# Altium project cyber60-mxhs.PrjPcb
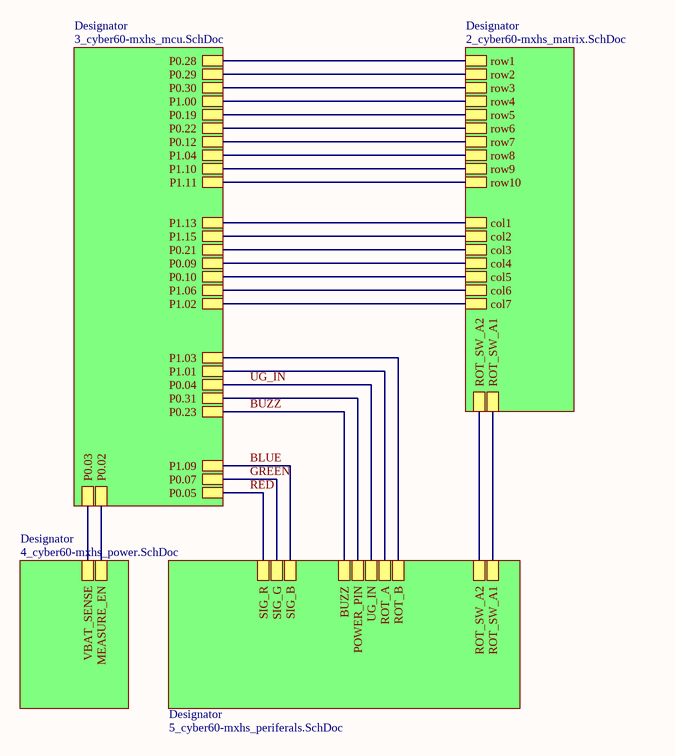
[diagram p0: 1_cyber60-mxhs_top.SchDoc]
ProjectTitle: cyber60 schematic; Revision: D2- MXHS
5 sheets, 227 parts. Net scope: hierarchical (ports join the sheet entries above them; power ports are global).
Board file: cyber60-mxhs.PcbDoc
Sheets:
  1_cyber60-mxhs_top.SchDoc
    Designator = 3_cyber60-mxhs_mcu.SchDoc
    Designator = 2_cyber60-mxhs_matrix.SchDoc
    Designator = 4_cyber60-mxhs_power.SchDoc
    Designator = 5_cyber60-mxhs_periferals.SchDoc

## Sheet 1_cyber60-mxhs_top.SchDoc: =ProjectTitle
size A4; Engineer: 4pplet; Address1: github.com/4pplet/cyber60; Address2: Licence: CERN-OHL-S; Revision: D2- MXHS; SheetNumber: 1; SheetTotal: 5; ProjectName: waffling60

### Sub-sheets
Designator = 3_cyber60-mxhs_mcu.SchDoc: P1.02, P1.04, P1.06, P0.12, P1.09, P1.11, P1.10, P0.07, P0.21, P0.23, P1.03, P1.00, P1.01, P0.22, P0.19, P0.10, P0.09, P0.31, P0.29, P1.13, P1.15, P0.05, P0.04, P0.02, P0.28, P0.30, P0.03
Designator = 2_cyber60-mxhs_matrix.SchDoc: col6, col5, col7, col3, col2, col1, col4, row3, row1, row4, row2, row5, row6, row9, row7, ROT_SW_A1, ROT_SW_A2, row8, row10
Designator = 4_cyber60-mxhs_power.SchDoc: VBAT_SENSE, MEASURE_EN
Designator = 5_cyber60-mxhs_periferals.SchDoc: ROT_SW_A2, ROT_B, ROT_A, ROT_SW_A1, POWER_PIN, BUZZ, SIG_B, SIG_R, SIG_G, UG_IN

### Nets
BLUE: sheet Designator/P1.09, sheet Designator/SIG_B
BUZZ: sheet Designator/P0.23, sheet Designator/BUZZ
col1: sheet Designator/P1.13, sheet Designator/col1
col2: sheet Designator/P1.15, sheet Designator/col2
col3: sheet Designator/P0.21, sheet Designator/col3
col4: sheet Designator/P0.09, sheet Designator/col4
col5: sheet Designator/P0.10, sheet Designator/col5
col6: sheet Designator/P1.06, sheet Designator/col6
col7: sheet Designator/P1.02, sheet Designator/col7, sheet Designator/ROT_SW_A2, sheet Designator/ROT_SW_A2
ENC_A: sheet Designator/P1.01, sheet Designator/ROT_A
ENC_B: sheet Designator/P1.03, sheet Designator/ROT_B
GREEN: sheet Designator/P0.07, sheet Designator/SIG_G
P0.02: sheet Designator/P0.02, sheet Designator/MEASURE_EN
P0.03: sheet Designator/P0.03, sheet Designator/VBAT_SENSE
P0.12: sheet Designator/P0.12, sheet Designator/row7
P0.19: sheet Designator/P0.19, sheet Designator/row5
P0.22: sheet Designator/P0.22, sheet Designator/row6
P0.28: sheet Designator/P0.28, sheet Designator/row1
P1.00: sheet Designator/P1.00, sheet Designator/row4
P1.04: sheet Designator/P1.04, sheet Designator/row8
P1.10: sheet Designator/P1.10, sheet Designator/row9
P1.11: sheet Designator/P1.11, sheet Designator/row10
RED: sheet Designator/P0.05, sheet Designator/SIG_R  [project net P0.05]
ROT_SW_A1: sheet Designator/ROT_SW_A1, sheet Designator/ROT_SW_A1
row2: sheet Designator/P0.29, sheet Designator/row2
row3: sheet Designator/P0.30, sheet Designator/row3
UG_IN: sheet Designator/P0.04, sheet Designator/UG_IN  [project net P0.04]
NetR501_1: sheet Designator/P0.31, sheet Designator/POWER_PIN

### Notes on the sheet
- Title
- Size:
- Date:
- A4
- Number:
- Time:
- Revision:
- Sheet
- of
- File:

## Sheet 3_cyber60-mxhs_mcu.SchDoc: =ProjectTitle
size A4; Address1: github.com/4pplet/cyber60; Address2: Licence: CERN-OHL-S; Revision: D2- MXHS; SheetNumber: 3; SheetTotal: 5
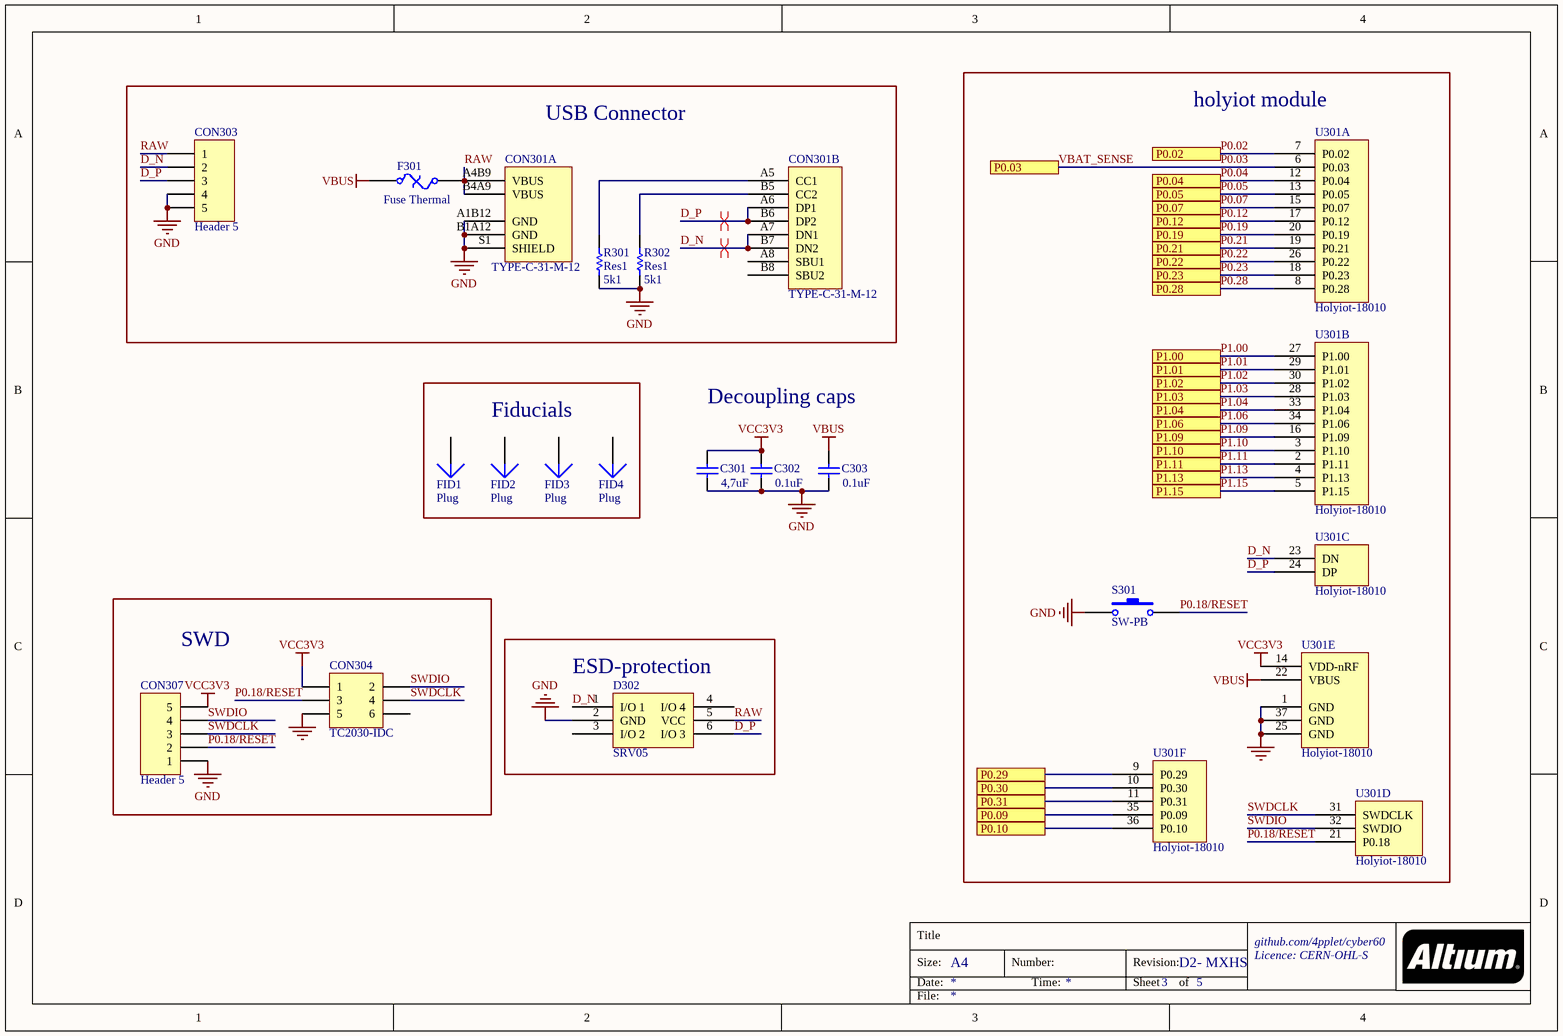
[diagram p1: 3_cyber60-mxhs_mcu.SchDoc]

### Parts
C301  value 4,7uF  [C0603[1608]]
C302  value 0.1uF  [C0603[1608]]
C303  value 0.1uF  [C0603[1608]]
CON301  TYPE-C-31-M-12  [TYPE-C-31-M-12]  (parts A,B of 2)
CON303  Header 5  [JST SM04B-SRSS-TB]
CON304  TC2030-IDC  [TC2030-IDC-NL]  (no BOM)
CON307  Header 5  [HDR1X5]  (no BOM)
D302  SRV05  [SOT-23-6]
F301  Fuse Thermal  [C1206[3216]]
FID1  Plug  [Fiducial_Nordic]  (no BOM)
FID2  Plug  [Fiducial_Nordic]  (no BOM)
FID3  Plug  [Fiducial_Nordic]  (no BOM)
FID4  Plug  [Fiducial_Nordic]  (no BOM)
R301  Res1  value 5k1  [R0603[1608]]
R302  Res1  value 5k1  [R0603[1608]]
S301  SW-PB  [XKB Switch]
U301  Holyiot-18010  [Holyiot-18010 - outer pads]  (parts A,B,C,D,E,F of 6)

### Blocks framed on the sheet
USB Connector: CON301 CON303 F301 R301 R302
holyiot module: S301 U301
Fiducials: FID1-FID4
SWD: CON304 CON307
ESD-protection: D302

### Ports
P0.02, P0.03, P0.04, P0.05, P0.07, P0.09, P0.10, P0.12, P0.19, P0.21, P0.22, P0.23, P0.28, P0.29, P0.30, P0.31, P1.00, P1.01, P1.02, P1.03, P1.04, P1.06, P1.09, P1.10, P1.11, P1.13, P1.15

### Nets
GND: C301.1 C302.1 C303.1 CON301.A1B12(GND) CON301.B1A12(GND) CON301.S1(SHIELD) CON303.4 CON303.5 CON304.5 CON307.1 D302.2(GND) R301.2 R302.2 S301.1 U301.1(GND) U301.25(GND) U301.37(GND)
VBUS: C303.2 F301.1 U301.22(VBUS)
VCC3V3: C301.2 C302.2 CON304.1 CON307.5 U301.14(VDD-nRF)
col4: U301.35(P0.09) ; port P0.09
col5: U301.36(P0.10) ; port P0.10
D_N: CON301.A7(DN1) CON301.B7(DN2) CON303.2 D302.1(I/O_1) U301.23(DN)
D_P: CON301.A6(DP1) CON301.B6(DP2) CON303.3 D302.6(I/O_3) U301.24(DP)
P0.02: U301.7(P0.02) ; port P0.02
P0.03: U301.6(P0.03) ; port P0.03  [also labelled VBAT_SENSE]
P0.04: U301.12(P0.04) ; port P0.04
P0.05: U301.13(P0.05) ; port P0.05
P0.07: U301.15(P0.07) ; port P0.07  [project net GREEN]
P0.12: U301.17(P0.12) ; port P0.12
P0.18/RESET: CON304.3 CON307.2 S301.2 U301.21(P0.18)
P0.19: U301.20(P0.19) ; port P0.19
P0.21: U301.19(P0.21) ; port P0.21  [project net col3]
P0.22: U301.26(P0.22) ; port P0.22
P0.23: U301.18(P0.23) ; port P0.23  [project net BUZZ]
P0.28: U301.8(P0.28) ; port P0.28
P1.00: U301.27(P1.00) ; port P1.00
P1.01: U301.29(P1.01) ; port P1.01  [project net ENC_A]
P1.02: U301.30(P1.02) ; port P1.02  [project net col7]
P1.03: U301.28(P1.03) ; port P1.03  [project net ENC_B]
P1.04: U301.33(P1.04) ; port P1.04
P1.06: U301.34(P1.06) ; port P1.06  [project net col6]
P1.09: U301.16(P1.09) ; port P1.09  [project net BLUE]
P1.10: U301.3(P1.10) ; port P1.10
P1.11: U301.2(P1.11) ; port P1.11
P1.13: U301.4(P1.13) ; port P1.13  [project net col1]
P1.15: U301.5(P1.15) ; port P1.15  [project net col2]
RAW: CON301.A4B9(VBUS) CON301.B4A9(VBUS) CON303.1 D302.5(VCC) F301.2
row2: U301.9(P0.29) ; port P0.29
row3: U301.10(P0.30) ; port P0.30
SWDCLK: CON304.4 CON307.3 U301.31(SWDCLK)
SWDIO: CON304.2 CON307.4 U301.32(SWDIO)
NetCON301_A5: CON301.A5(CC1) R301.1
NetCON301_B5: CON301.B5(CC2) R302.1
NetR501_1: U301.11(P0.31) ; port P0.31

Not connected (* = marked no-connect by the designer): CON301 A8(SBU1) B8(SBU2); CON304 6; D302 3(I/O_2) 4(I/O_4); FID1 1; FID2 1; FID3 1; FID4 1

### Layout directives
differential pair: D_N, D_P

### Notes on the sheet
- Decoupling caps
- Title
- Size:
- Date:
- A4
- Number:
- Time:
- Revision:
- Sheet
- of
- File:

### Library data of the parts
C301 = Cap: Capacitor; MRF.Part: CL10A475KO8NNNC; LCSC MFG: Samsung Electro-Mechanics; LCSC Part #: C19666
C302 C303 = Cap: Capacitor; MRF.Part: CC0603KRX7R9BB104; MFG: KEMET; MFGPN: C0603C104M5RACTU; LCSC MFG: YAGEO; Version: 0603 imperial; LCSC Part #: C14663
CON301 = TYPE-C-31-M-12: MFG: Korean Hroparts Elec; MFGPN: TYPE-C-31-M-12; LCSC Part #: C165948; LCSC MFG: Korean Hroparts Elec; MRF.Part: TYPE-C-31-M-12
CON303 = Header 5: JST for USB daughter board; MFGPN: SM04B-SRSS-TB(LF)(SN); MFG: JST Sales America Inc.; LCSC MFG: JST Sales America; LCSC Part #: C160404; MRF.Part: SM04B-SRSS-TB(LF)(SN)
CON304 = Header 3X2: Header, 3-Pin, Dual row
CON307 = Header 5: Header, 5-Pin
D302 = SRV05: MRF.Part: SRV05-4-P-T7; LCSC MFG: ProTek Devices; LCSC Part #: C85364
F301 = Fuse Thermal: Thermal Fuse; MRF.Part: ASMD1206-050; MFG: Bel Fuse Inc.; MFGPN: 0ZCJ0050FF2G; LCSC MFG: Shenzhen JDT Fuse; LCSC Part #: C135338
R301 R302 = Res1: Resistor; MRF.Part: 0603WAF5101T5E; MFG: Panasonic Electronic Components; MFGPN: ERJ-3EKF5101V; LCSC MFG: Uniroyal Elec; Version: 0603 imperial; LCSC Part #: C23186
S301 = SW-PB: Switch; MRF.Part: TS-1187A-C-D-B; MFGPN: PTS645SM43SMTR92 LFS; MFG: C&K; LCSC MFG: XKB Enterprise; LCSC Part #: C318888
U301 = Holyiot-18010: MFGPN: 18010; MFG: HolyIOT

## Sheet 2_cyber60-mxhs_matrix.SchDoc: =ProjectTitle
size A3; Address1: github.com/4pplet/cyber60; Address2: Licence: CERN-OHL-S; Revision: D2- MXHS; SheetNumber: 2; SheetTotal: 5
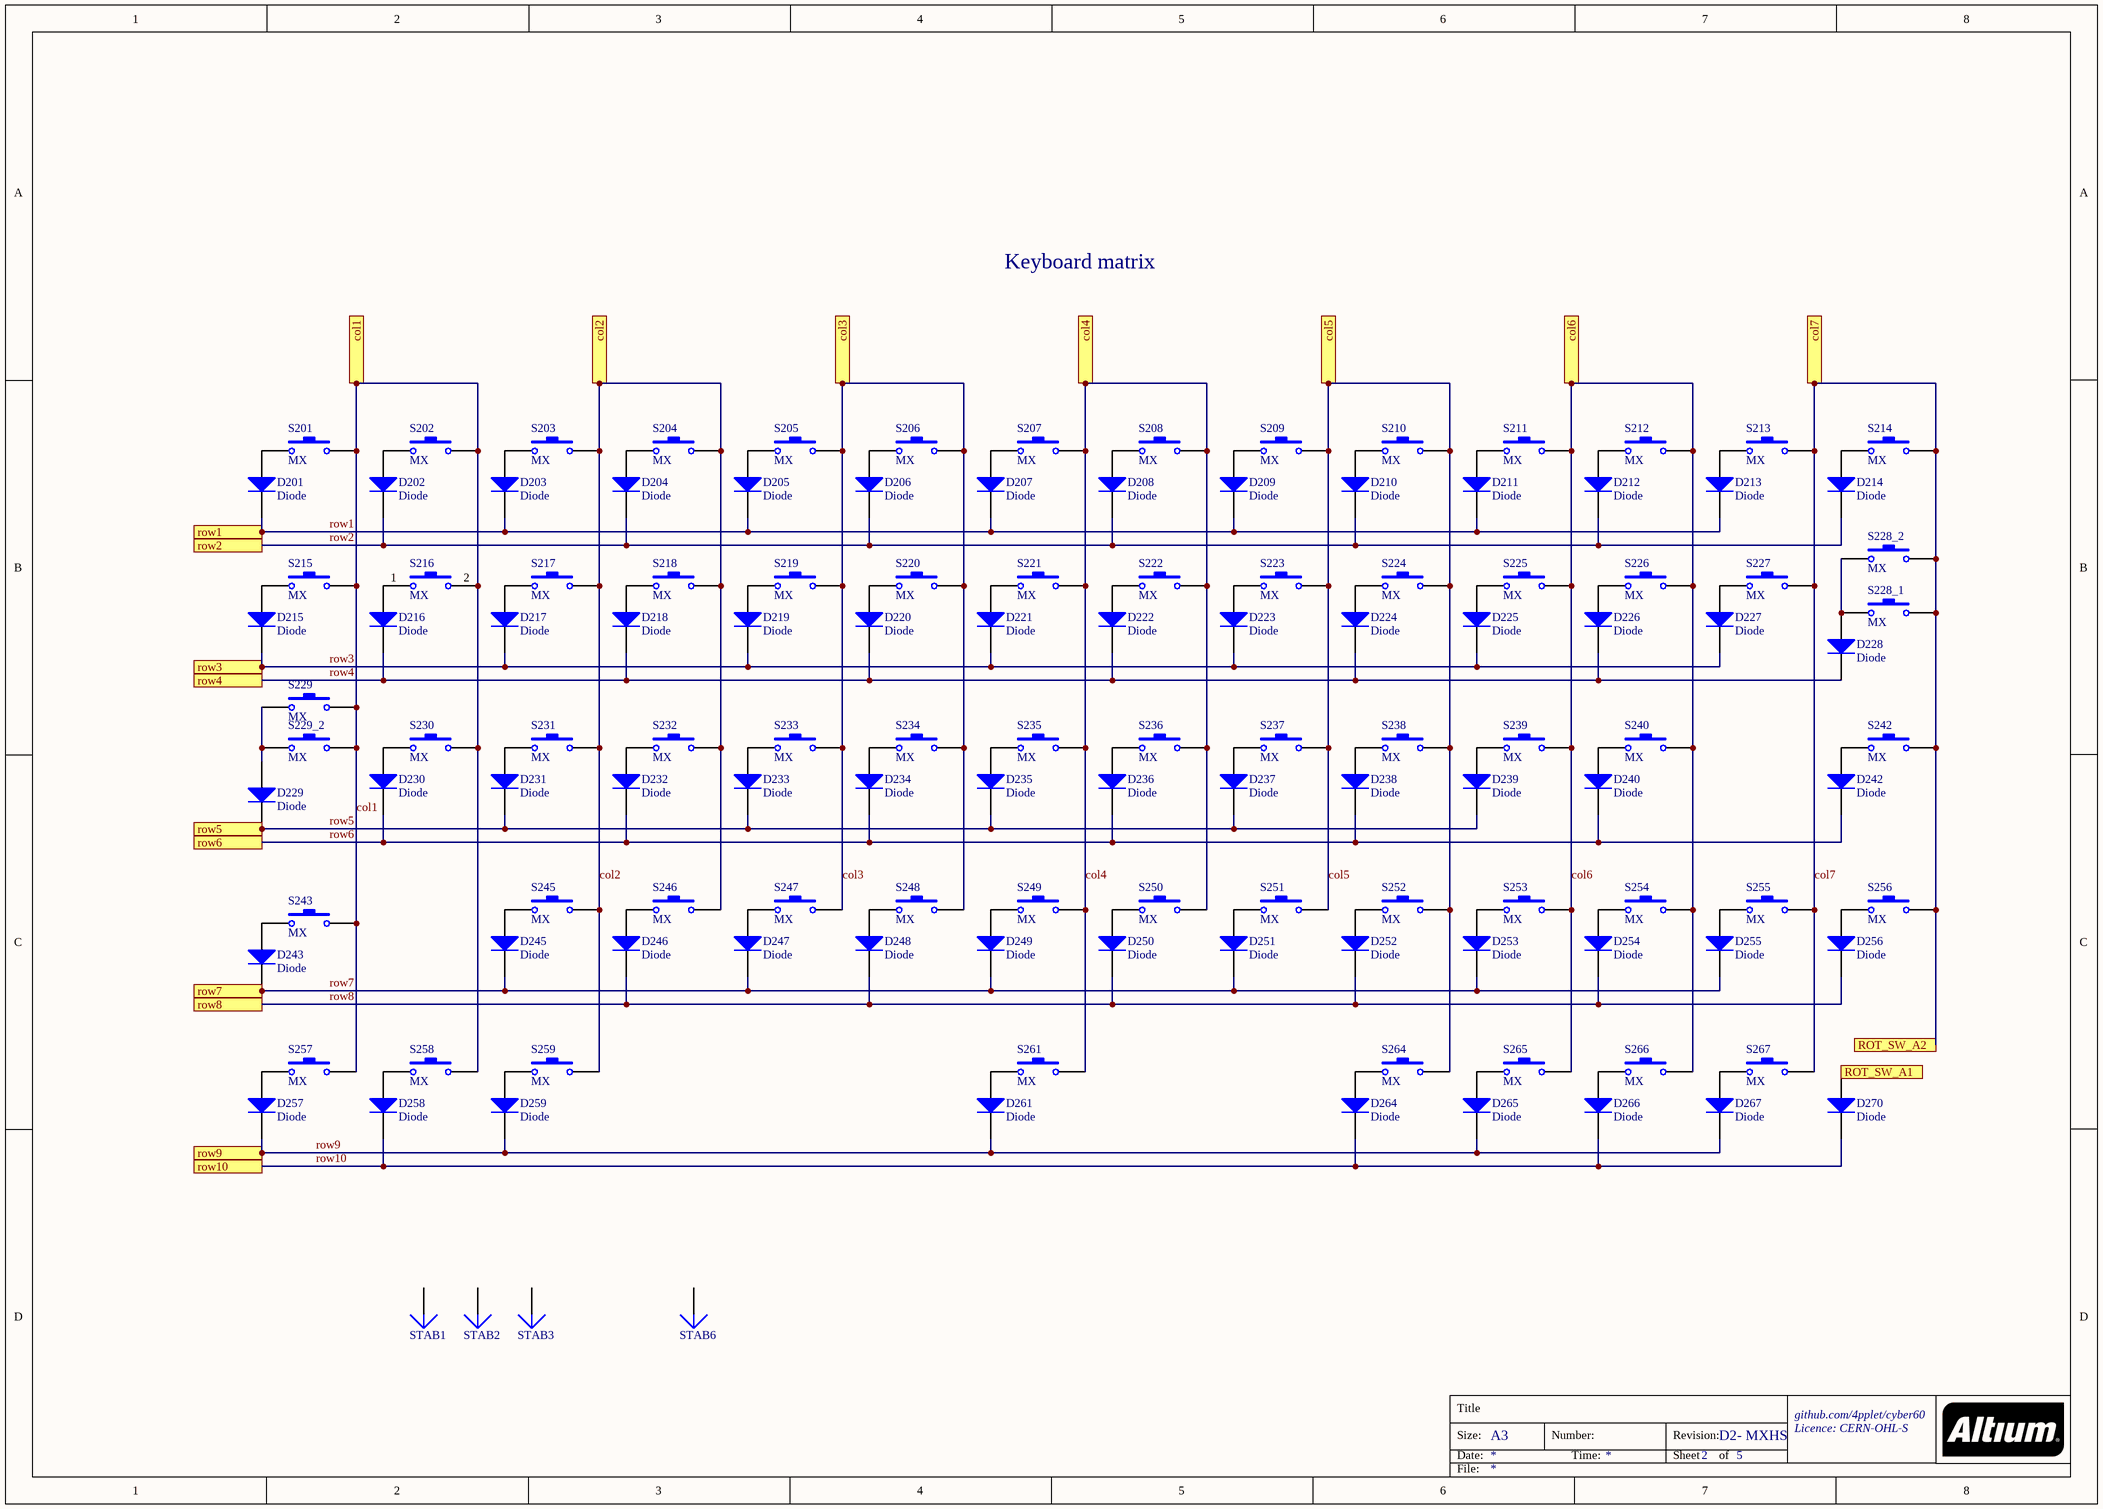
[diagram p2: 2_cyber60-mxhs_matrix.SchDoc]

### Parts
D201  Diode  [SOD-123]
D202  Diode  [SOD-123]
D203  Diode  [SOD-123]
D204  Diode  [SOD-123]
D205  Diode  [SOD-123]
D206  Diode  [SOD-123]
D207  Diode  [SOD-123]
D208  Diode  [SOD-123]
D209  Diode  [SOD-123]
D210  Diode  [SOD-123]
D211  Diode  [SOD-123]
D212  Diode  [SOD-123]
D213  Diode  [SOD-123]
D214  Diode  [SOD-123]
D215  Diode  [SOD-123]
D216  Diode  [SOD-123]
D217  Diode  [SOD-123]
D218  Diode  [SOD-123]
D219  Diode  [SOD-123]
D220  Diode  [SOD-123]
D221  Diode  [SOD-123]
D222  Diode  [SOD-123]
D223  Diode  [SOD-123]
D224  Diode  [SOD-123]
D225  Diode  [SOD-123]
D226  Diode  [SOD-123]
D227  Diode  [SOD-123]
D228  Diode  [SOD-123]
D229  Diode  [SOD-123]
D230  Diode  [SOD-123]
D231  Diode  [SOD-123]
D232  Diode  [SOD-123]
D233  Diode  [SOD-123]
D234  Diode  [SOD-123]
D235  Diode  [SOD-123]
D236  Diode  [SOD-123]
D237  Diode  [SOD-123]
D238  Diode  [SOD-123]
D239  Diode  [SOD-123]
D240  Diode  [SOD-123]
D242  Diode  [SOD-123]
D243  Diode  [SOD-123]
D245  Diode  [SOD-123]
D246  Diode  [SOD-123]
D247  Diode  [SOD-123]
D248  Diode  [SOD-123]
D249  Diode  [SOD-123]
D250  Diode  [SOD-123]
D251  Diode  [SOD-123]
D252  Diode  [SOD-123]
D253  Diode  [SOD-123]
D254  Diode  [SOD-123]
D255  Diode  [SOD-123]
D256  Diode  [SOD-123]
D257  Diode  [SOD-123]
D258  Diode  [SOD-123]
D259  Diode  [SOD-123]
D261  Diode  [SOD-123]
D264  Diode  [SOD-123]
D265  Diode  [SOD-123]
D266  Diode  [SOD-123]
D267  Diode  [SOD-123]
D270  Diode  [SOD-123]
S201  MX  [MXHS-switch - 1U Top layer - switched pol AS2]
S202  MX  [MXHS-switch - 1U Top layer - switched pol AS2]
S203  MX  [MXHS-switch - 1U Top layer - AS2]
S204  MX  [MXHS-switch - 1U Top layer - switched pol AS2]
S205  MX  [MXHS-switch - 1U Top layer - AS2]
S206  MX  [MXHS-switch - 1U Top layer - AS2]
S207  MX  [MXHS-switch - 1U Top layer - AS2]
S208  MX  [MXHS-switch - 1U Top layer - AS2]
S209  MX  [MXHS-switch - 1U Top layer - AS2]
S210  MX  [MXHS-switch - 1U Top layer - switched pol AS2]
S211  MX  [MXHS-switch - 1U Top layer - AS2]
S212  MX  [MXHS-switch - 1U Top layer - AS2]
S213  MX  [MXHS-switch - 1U Top layer - switched pol AS2]
S214  MX  [MXHS-switch - 1U Top layer - AS2 - S2]
S215  MX  [MXHS-switch - 1U Top layer - switched pol AS2]
S216  MX  [MXHS-switch - 1U Top layer - AS2 - S1]
S217  MX  [MXHS-switch - 1U Top layer - AS2]
S218  MX  [MXHS-switch - 1U Top layer - AS2]
S219  MX  [MXHS-switch - 1U Top layer - AS2]
S220  MX  [MXHS-switch - 1U Top layer - switched pol AS2]
S221  MX  [MXHS-switch - 1U Top layer - switched pol AS2]
S222  MX  [MXHS-switch - 1U Top layer - AS2]
S223  MX  [MXHS-switch - 1U Top layer - AS2]
S224  MX  [MXHS-switch - 1U Top layer - AS2]
S225  MX  [MXHS-switch - 1U Top layer - AS2]
S226  MX  [MXHS-switch - 1U Top layer - switched pol AS2]
S227  MX  [MXHS-switch - 1U Top layer - switched pol AS2]
S228_1  MX  [MXHS-switch - 1U Top layer - AS2 - S1]
S228_2  MX  [MXHS-switch - 1U Top layer - AS2 - S2]
S229  MX  [MXHS-switch - 1U Top layer - AS2]
S229_2  MX  [MXHS-switch - 1U Top layer - switched pol AS2]
S230  MX  [MXHS-switch - 1U Top layer - AS2]
S231  MX  [MXHS-switch - 1U Top layer - AS2]
S232  MX  [MXHS-switch - 1U Top layer - AS2]
S233  MX  [MXHS-switch - 1U Top layer - AS2]
S234  MX  [MXHS-switch - 1U Top layer - switched pol AS2]
S235  MX  [MXHS-switch - 1U Top layer - AS2 - S2]
S236  MX  [MXHS-switch - 1U Top layer - AS2]
S237  MX  [MXHS-switch - 1U Top layer - AS2]
S238  MX  [MXHS-switch - 1U Top layer - AS2]
S239  MX  [MXHS-switch - 1U Top layer - switched pol AS2]
S240  MX  [MXHS-switch - 1U Top layer - AS2]
S242  MX  [MXHS-switch - 1U Top layer - AS2 - S2]
S243  MX  [MXHS-switch - 1U Top layer - AS2]
S245  MX  [MXHS-switch - 1U Top layer - AS2]
S246  MX  [MXHS-switch - 1U Top layer - AS2]
S247  MX  [MXHS-switch - 1U Top layer - AS2]
S248  MX  [MXHS-switch - 1U Top layer - switched pol AS2]
S249  MX  [MXHS-switch - 1U Top layer - switched pol AS2]
S250  MX  [MXHS-switch - 1U Top layer - switched pol AS2]
S251  MX  [MXHS-switch - 1U Top layer - AS2]
S252  MX  [MXHS-switch - 1U Top layer - AS2]
S253  MX  [MXHS-switch - 1U Top layer - AS2]
S254  MX  [MXHS-switch - 1U Top layer - AS2]
S255  MX  [MXHS-switch - 1U Top layer - switched pol AS2]
S256  MX  [MXHS-switch - 1U Top layer - switched pol AS2]
S257  MX  [MXHS-switch - 1U Top layer - AS2]
S258  MX  [MXHS-switch - 1U Top layer - AS2]
S259  MX  [MXHS-switch - 1U Top layer - AS2]
S261  MX  [MXHS-switch - 1U Top layer - AS2]
S264  MX  [MXHS-switch - 1U Top layer - switched pol AS2]
S265  MX  [MXHS-switch - 1U Top layer - switched pol AS2]
S266  MX  [MXHS-switch - 1U Top layer - switched pol AS2]
S267  MX  [MXHS-switch - 1U Top layer - AS2]
STAB1  Plug  [Stab 2u]  (value not drawn)  (no BOM)
STAB2  Plug  [Stab 2u]  (value not drawn)  (no BOM)
STAB3  Plug  [Stab 7U]  (value not drawn)  (no BOM)
STAB6  Plug  [Stab 2u]  (value not drawn)  (no BOM)

### Ports
col1, col2, col3, col4, col5, col6, col7, ROT_SW_A1, ROT_SW_A2, row1, row2, row3, row4, row5, row6, row7, row8, row9, row10

### Nets
col1: S201.2 S202.2 S215.2 S216.2 S229.2 S229_2.2 S230.2 S243.2 S257.2 S258.2 ; port col1
col2: S203.2 S204.2 S217.2 S218.2 S231.2 S232.2 S245.2 S246.2 S259.2 ; port col2
col3: S205.2 S206.2 S219.2 S220.2 S233.2 S234.2 S247.2 S248.2 ; port col3
col4: S207.2 S208.2 S221.2 S222.2 S235.2 S236.2 S249.2 S250.2 S261.1 ; port col4
col5: S209.2 S210.2 S223.2 S224.2 S237.2 S238.2 S251.2 S252.2 S264.1 ; port col5
col6: S211.2 S212.2 S225.2 S226.2 S239.2 S240.2 S253.2 S254.2 S265.2 S266.2 ; port col6
col7: S213.2 S214.2 S227.2 S228_1.2 S228_2.1 S242.1 S255.2 S256.2 S267.2 ; port col7, port ROT_SW_A2
ROT_SW_A1: D270.1(A) ; port ROT_SW_A1
row1: D201.2(K) D203.2(K) D205.2(K) D207.2(K) D209.2(K) D211.2(K) D213.2(K) ; port row1  [project net P0.28]
row2: D202.2(K) D204.2(K) D206.2(K) D208.2(K) D210.2(K) D212.2(K) D214.2(K) ; port row2
row3: D215.2(K) D217.2(K) D219.2(K) D221.2(K) D223.2(K) D225.2(K) D227.2(K) ; port row3
row4: D216.2(K) D218.2(K) D220.2(K) D222.2(K) D224.2(K) D226.2(K) D228.2(K) ; port row4  [project net P1.00]
row5: D229.2(K) D231.2(K) D233.2(K) D235.2(K) D237.2(K) D239.2(K) ; port row5  [project net P0.19]
row6: D230.2(K) D232.2(K) D234.2(K) D236.2(K) D238.2(K) D240.2(K) D242.2(K) ; port row6  [project net P0.22]
row7: D243.2(K) D245.2(K) D247.2(K) D249.2(K) D251.2(K) D253.2(K) D255.2(K) ; port row7  [project net P0.12]
row8: D246.2(K) D248.2(K) D250.2(K) D252.2(K) D254.2(K) D256.2(K) ; port row8  [project net P1.04]
row9: D257.2(K) D259.2(K) D261.2(K) D265.2(K) D267.2(K) ; port row9  [project net P1.10]
row10: D258.2(K) D264.2(K) D266.2(K) D270.2(K) ; port row10  [project net P1.11]
NetD201_1: D201.1(A) S201.1
NetD202_1: D202.1(A) S202.1
NetD203_1: D203.1(A) S203.1
NetD204_1: D204.1(A) S204.1
NetD205_1: D205.1(A) S205.1
NetD206_1: D206.1(A) S206.1
NetD207_1: D207.1(A) S207.1
NetD208_1: D208.1(A) S208.1
NetD209_1: D209.1(A) S209.1
NetD210_1: D210.1(A) S210.1
NetD211_1: D211.1(A) S211.1
NetD212_1: D212.1(A) S212.1
NetD213_1: D213.1(A) S213.1
NetD214_1: D214.1(A) S214.1
NetD215_1: D215.1(A) S215.1
NetD216_1: D216.1(A) S216.1
NetD217_1: D217.1(A) S217.1
NetD218_1: D218.1(A) S218.1
NetD219_1: D219.1(A) S219.1
NetD220_1: D220.1(A) S220.1
NetD221_1: D221.1(A) S221.1
NetD222_1: D222.1(A) S222.1
NetD223_1: D223.1(A) S223.1
NetD224_1: D224.1(A) S224.1
NetD225_1: D225.1(A) S225.1
NetD226_1: D226.1(A) S226.1
NetD227_1: D227.1(A) S227.1
NetD228_1: D228.1(A) S228_1.1 S228_2.2
NetD229_1: D229.1(A) S229.1 S229_2.1
NetD230_1: D230.1(A) S230.1
NetD231_1: D231.1(A) S231.1
NetD232_1: D232.1(A) S232.1
NetD233_1: D233.1(A) S233.1
NetD234_1: D234.1(A) S234.1
NetD235_1: D235.1(A) S235.1
NetD236_1: D236.1(A) S236.1
NetD237_1: D237.1(A) S237.1
NetD238_1: D238.1(A) S238.1
NetD239_1: D239.1(A) S239.1
NetD240_1: D240.1(A) S240.1
NetD242_1: D242.1(A) S242.2
NetD243_1: D243.1(A) S243.1
NetD245_1: D245.1(A) S245.1
NetD246_1: D246.1(A) S246.1
NetD247_1: D247.1(A) S247.1
NetD248_1: D248.1(A) S248.1
NetD249_1: D249.1(A) S249.1
NetD250_1: D250.1(A) S250.1
NetD251_1: D251.1(A) S251.1
NetD252_1: D252.1(A) S252.1
NetD253_1: D253.1(A) S253.1
NetD254_1: D254.1(A) S254.1
NetD255_1: D255.1(A) S255.1
NetD256_1: D256.1(A) S256.1
NetD257_1: D257.1(A) S257.1
NetD258_1: D258.1(A) S258.1
NetD259_1: D259.1(A) S259.1
NetD261_1: D261.1(A) S261.2
NetD264_1: D264.1(A) S264.2
NetD265_1: D265.1(A) S265.1
NetD266_1: D266.1(A) S266.1
NetD267_1: D267.1(A) S267.1

Not connected (* = marked no-connect by the designer): STAB1 1; STAB2 1; STAB3 1; STAB6 1

### Notes on the sheet
- Keyboard matrix
- Title
- Size:
- Date:
- A3
- Number:
- Time:
- Revision:
- Sheet
- of
- File:

### Library data of the parts
D201-D240 D242 D243 D245-D259 D261 D264-D267 D270 = Diode: Default Diode; MRF.Part: 1N4148W; LCSC MFG: ST(Semtech); Version: SOD-123; LCSC Part #: C81598
S201-S214 S216-S227 S228_1 S228_2 S229 S229_2 S230-S240 S242 S243 S245-S259 S261 S264-S267 = SW-PB: Switch; MRF.Part: CPG151101S11; LCSC MFG: Kailh; LCSC Part #: C2803348
S215 = SW-PB: TAB; MRF.Part: CPG151101S11; LCSC MFG: Kailh; LCSC Part #: C2803348

## Sheet 4_cyber60-mxhs_power.SchDoc: =ProjectTitle
size A4; Address1: github.com/4pplet/cyber60; Address2: Licence: CERN-OHL-S; Revision: D2- MXHS; SheetNumber: 4; SheetTotal: 5; ProjectName: cyber60-mxhs.PrjPcb
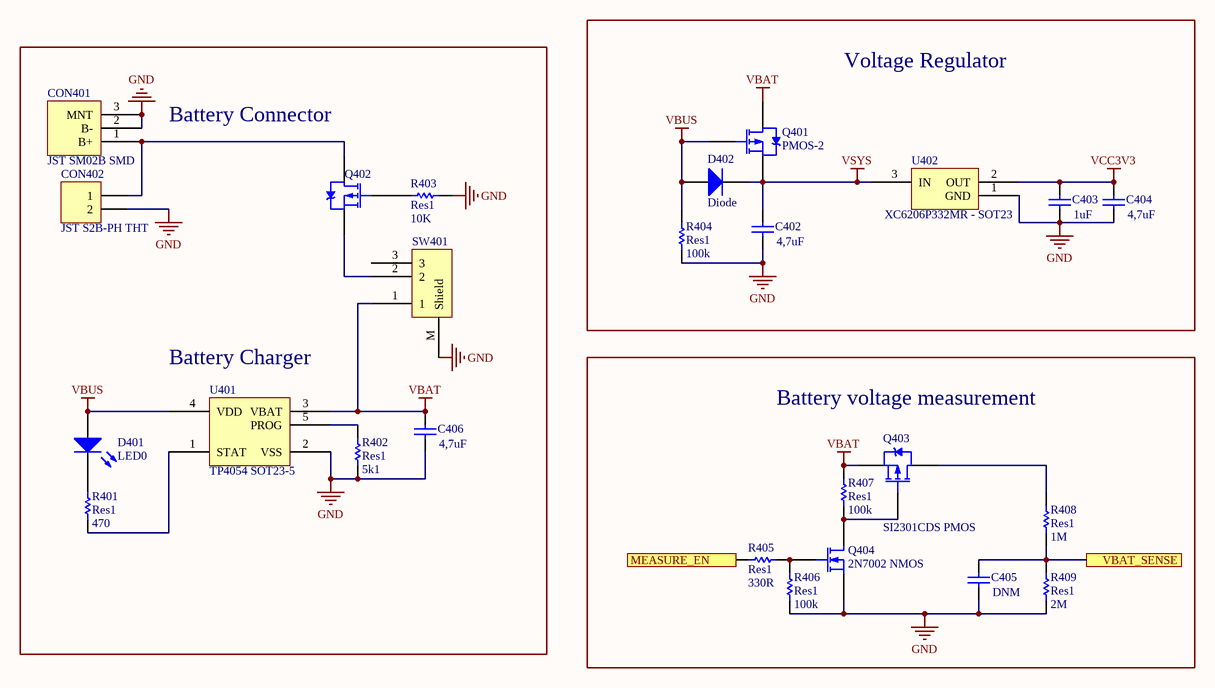
[diagram p3: 4_cyber60-mxhs_power.SchDoc]

### Parts
C402  value 4,7uF  [C0603[1608]]
C403  value 1uF  [C0603[1608]]
C404  value 4,7uF  [C0603[1608]]
C405  DNM  [C0603[1608]]  (no BOM)
C406  value 4,7uF  [C0603[1608]]
CON401  JST SM02B SMD  [JST SM02B-SRSS-TB]
CON402  JST S2B-PH THT  [JST S2B-PH-K(LF)(SN)]  (no BOM)
D401  LED0  [LED0603[1608]]
D402  Diode  [SOD-123]
Q401  PMOS-2  [SOT-23-3]
Q402  PMOS-2  [SOT-23-3]  (value not drawn)
Q403  SI2301CDS PMOS  [SOT-23-3]
Q404  2N7002 NMOS  [SOT-23-3]
R401  Res1  value 470  [R0603[1608]]
R402  Res1  value 5k1  [R0603[1608]]
R403  Res1  value 10K  [R0603[1608]]
R404  Res1  value 100k  [R0603[1608]]
R405  Res1  value 330R  [R0603[1608]]
R406  Res1  value 100k  [R0603[1608]]
R407  Res1  value 100k  [R0603[1608]]
R408  Res1  value 1M  [R0603[1608]]
R409  Res1  value 2M  [R0603[1608]]
SW401  Korean Hroparts Elec K3-1296S-E2  [Korean Hroparts Elec K3-1296S-E2]  (value not drawn)
U401  TP4054 SOT23-5  [SOT-23-5]
U402  XC6206P332MR - SOT23  [SOT-23-3]

### Blocks framed on the sheet
Voltage Regulator: C402-C404 D402 Q401 R404 U402
Battery voltage measurement: C405 Q403 Q404 R405-R409

### Ports
MEASURE_EN, VBAT_SENSE

### Nets
GND: C402.1 C403.1 C404.1 C405.1 C406.1 CON401.2(B-) CON401.3(MNT) CON402.2 Q404.2(S) R402.2 R403.2 R404.2 R406.2 R409.2 SW401.M(Shield) U401.2(VSS) U402.1(GND)
VBAT: C406.2 Q401.3(D) Q403.2(S) R407.1 SW401.1 U401.3(VBAT)
VBUS: D401.1(A) D402.1(A) Q401.1(G) R404.1 U401.4(VDD)
VCC3V3: C403.2 C404.2 U402.2(OUT)
VSYS: C402.2 D402.2(K) Q401.2(S) U402.3(IN)
P0.02: R405.1 ; port MEASURE_EN
P0.03: C405.2 R408.2 R409.1 ; port VBAT_SENSE
NetCON401_1: CON401.1(B+) CON402.1 Q402.3(D)
NetD401_2: D401.2(K) R401.2
NetQ402_1: Q402.1(G) R403.1
NetQ402_2: Q402.2(S) SW401.2
NetQ403_1: Q403.1(G) Q404.3(D) R407.2
NetQ403_3: Q403.3(D) R408.1
NetQ404_1: Q404.1(G) R405.2 R406.1
NetR401_1: R401.1 U401.1(STAT)
NetR402_1: R402.1 U401.5(PROG)

Not connected (* = marked no-connect by the designer): SW401 3

### Notes on the sheet
- Battery Connector
- (near U401) Battery Charger
- Title
- Size:
- Date:
- A4
- Number:
- Time:
- Revision:
- Sheet
- of
- File:

### Library data of the parts
C402 C404 C406 = Cap: as C301 on sheet 3_cyber60-mxhs_mcu; LCSC Part #: C19666
C403 = Cap: Capacitor; MRF.Part: CL10A105KB8NNNC; MFG: KEMET; MFGPN: C0603C104M5RACTU; LCSC MFG: Samsung Electro-Mechanics; Version: 0603 imperial; LCSC Part #: C15849
C405 = Cap: Capacitor; Value: DNM; Version: 0603 imperial
CON401 = JST S2B-PH-SM4-TB: MRF.Part: SM02B-SRSS-TB(LF)(SN); LCSC MFG: JST Sales America; LCSC Part #: C160402
CON402 = Header 2: Header, 2-Pin; MRF.Part: S2B-PH-K(LF)(SN); LCSC MFG: JST Sales America; LCSC Part #: C265016
D401 = LED0: Typical INFRARED GaAs LED; MRF.Part: 19-213/Y2C-CQ2R2L/3T(CY); LCSC MFG: Everlight Elec; LCSC Part #: C72038
D402 = Diode: Default Diode; MRF.Part: B5819W; LCSC MFG: Changjiang Electronics Tech (CJ); Version: SOD-123; LCSC Part #: C8598
Q401 Q403 = PMOS-2: P-Channel Power MOSFET; MRF.Part: SI2301CDS-T1-GE3; Note: Pin 4 not drawn and electrically connected to Pin 2.; LCSC MFG: Vishay Intertech; LCSC Part #: C10487
Q402 = PMOS-2: P-Channel Power MOSFET; MRF.Part: SI2301CDS-T1-GE3; LCSC MFG: Vishay Intertech; LCSC Part #: C10487; Version: SOT23-3
Q404 = MOSFET-N: N-Channel MOSFET; LCSC MFG: Changjiang Electronics Tech (CJ); LCSC Part #: C8545; MRF.Part: 2N7002
R401 = Res1: Resistor; MRF.Part: 0603WAF4700T5E; MFG: Panasonic Electronic Components; MFGPN: ERJ-3EKF5101V; LCSC MFG: UNI-ROYAL(Uniroyal Elec); Version: 0603 imperial; LCSC Part #: C23179
R402 = Res1: as R301 on sheet 3_cyber60-mxhs_mcu; Version: 0603 imperial; LCSC Part #: C23186
R403 = Res1: Resistor; MRF.Part: 0603WAF1002T5E; MFG: Panasonic Electronic Components; MFGPN: ERJ-3EKF5101V; LCSC MFG: Uniroyal Elec; Version: 0603 imperial; LCSC Part #: C25804
R404 R406 R407 = Res1: Resistor; MRF.Part: 0603WAF1003T5E; LCSC MFG: Uniroyal Elec; Version: 0603 imperial; LCSC Part #: C25803
R405 = Res1: Resistor; MRF.Part: 0603WAF3300T5E; LCSC MFG: Uniroyal Elec; Version: 0603 imperial; LCSC Part #: C23138
R408 = Res1: Resistor; MRF.Part: 0603WAF1004T5E; LCSC MFG: Uniroyal Elec; Version: 0603 imperial; LCSC Part #: C22935
R409 = Res1: Resistor; MRF.Part: 0603WAF2004T5E; LCSC MFG: Uniroyal Elec; Version: 0603 imperial; LCSC Part #: C22976
U401 = MCP73831: LCSC MFG: Nanjing Extension Microelectronics; LCSC Part #: C32574; MRF.Part: TP4054
U402 = SOT23 LDO: LCSC MFG: Torex Semicon; MFG: Texas Instruments; MFGPN: TPS7A0533PDBZ; LCSC Part #: C5446; MRF.Part: XC6206P332MR
SW401 = Korean Hroparts Elec K3-1296S-E2: LCSC MFG: Korean Hroparts Elec; LCSC Part #: C136659; MFGPN: K3-1296S-E2

## Sheet 5_cyber60-mxhs_periferals.SchDoc: =ProjectTitle
size A4; Address1: github.com/4pplet/cyber60; Address2: Licence: CERN-OHL-S; Revision: D2- MXHS; SheetNumber: 5; SheetTotal: 5
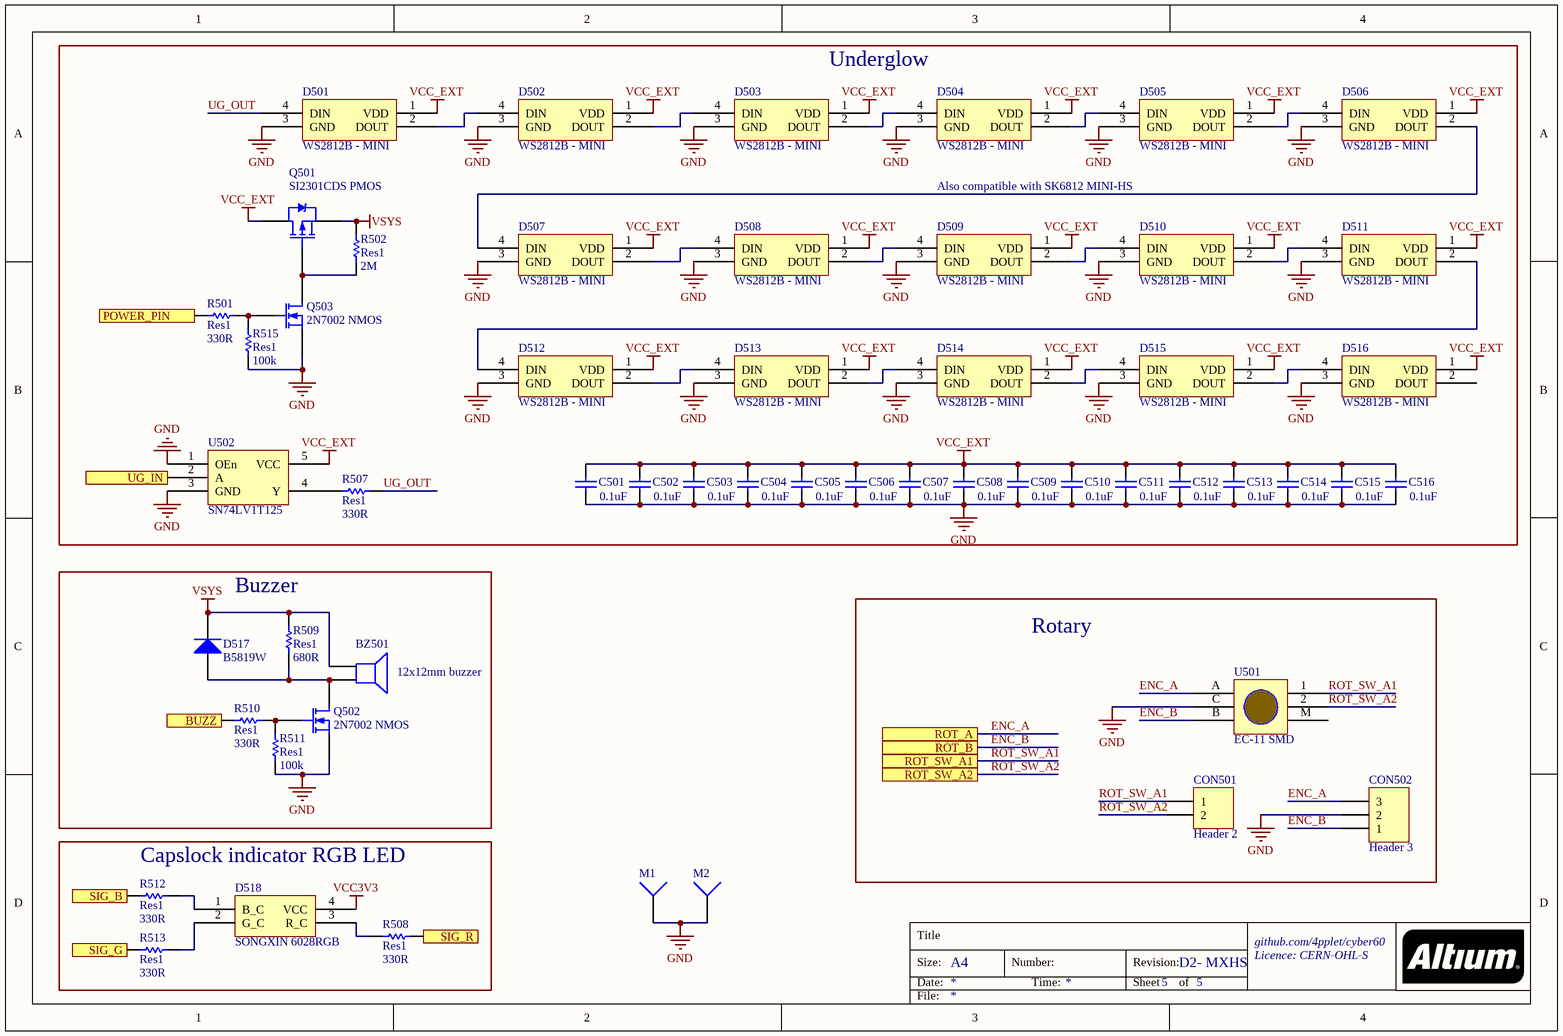
[diagram p4: 5_cyber60-mxhs_periferals.SchDoc]

### Parts
BZ501  12x12mm buzzer  [buzzer 12x12]
C501  value 0.1uF  [C0603[1608]]
C502  value 0.1uF  [C0603[1608]]
C503  value 0.1uF  [C0603[1608]]
C504  value 0.1uF  [C0603[1608]]
C505  value 0.1uF  [C0603[1608]]
C506  value 0.1uF  [C0603[1608]]
C507  value 0.1uF  [C0603[1608]]
C508  value 0.1uF  [C0603[1608]]
C509  value 0.1uF  [C0603[1608]]
C510  value 0.1uF  [C0603[1608]]
C511  value 0.1uF  [C0603[1608]]
C512  value 0.1uF  [C0603[1608]]
C513  value 0.1uF  [C0603[1608]]
C514  value 0.1uF  [C0603[1608]]
C515  value 0.1uF  [C0603[1608]]
C516  value 0.1uF  [C0603[1608]]
CON501  Header 2  [HDR1X2]  (no BOM)
CON502  Header 3  [HDR1X3]  (no BOM)
D501  WS2812B - MINI  [WS2812B - 2020]
D502  WS2812B - MINI  [WS2812B - 2020]
D503  WS2812B - MINI  [WS2812B - 2020]
D504  WS2812B - MINI  [WS2812B - 2020]
D505  WS2812B - MINI  [WS2812B - 2020]
D506  WS2812B - MINI  [WS2812B - 2020]
D507  WS2812B - MINI  [WS2812B - 2020]
D508  WS2812B - MINI  [WS2812B - 2020]
D509  WS2812B - MINI  [WS2812B - 2020]
D510  WS2812B - MINI  [WS2812B - 2020]
D511  WS2812B - MINI  [WS2812B - 2020]
D512  WS2812B - MINI  [WS2812B - 2020]
D513  WS2812B - MINI  [WS2812B - 2020]
D514  WS2812B - MINI  [WS2812B - 2020]
D515  WS2812B - MINI  [WS2812B - 2020]
D516  WS2812B - MINI  [WS2812B - 2020]
D517  B5819W  [SOD-123]
D518  SONGXIN 6028RGB  [SONGXIN 6028RGB - shaped]
M1  Socket  [mounting_hole]  (value not drawn)  (no BOM)
M2  Socket  [mounting_hole]  (value not drawn)  (no BOM)
Q501  SI2301CDS PMOS  [SOT-23-3]
Q502  2N7002 NMOS  [SOT-23-3]
Q503  2N7002 NMOS  [SOT-23-3]
R501  Res1  value 330R  [R0603[1608]]
R502  Res1  value 2M  [R0603[1608]]
R507  Res1  value 330R  [R0603[1608]]
R508  Res1  value 330R  [R0603[1608]]
R509  Res1  value 680R  [R0603[1608]]
R510  Res1  value 330R  [R0603[1608]]
R511  Res1  value 100k  [R0603[1608]]
R512  Res1  value 330R  [R0603[1608]]
R513  Res1  value 330R  [R0603[1608]]
R515  Res1  value 100k  [R0603[1608]]
U501  EC-11 SMD  [EC11-SMD]
U502  SN74LV1T125  [SOT-23-5]

### Blocks framed on the sheet
Underglow: C501-C516 D501-D516 Q501 Q503 R501 R502 R507 R515 U502
Buzzer: BZ501 D517 Q502 R509-R511
Rotary: CON501 CON502 U501
Capslock indicator RGB LED: D518 R508 R512 R513

### Ports
BUZZ, POWER_PIN, ROT_A, ROT_B, ROT_SW_A1, ROT_SW_A2, SIG_B, SIG_G, SIG_R, UG_IN

### Nets
GND: C501.1 C502.1 C503.1 C504.1 C505.1 C506.1 C507.1 C508.1 C509.1 C510.1 C511.1 C512.1 C513.1 C514.1 C515.1 C516.1 CON502.2 D501.3(GND) D502.3(GND) D503.3(GND) D504.3(GND) D505.3(GND) D506.3(GND) D507.3(GND) D508.3(GND) D509.3(GND) D510.3(GND) D511.3(GND) D512.3(GND) D513.3(GND) D514.3(GND) D515.3(GND) D516.3(GND) M1.1 M2.1 Q502.2(S) Q503.2(S) R511.2 R515.2 U501.C U502.1(OEn) U502.3(GND)
VCC3V3: D518.4(VCC)
VCC_EXT: C501.2 C502.2 C503.2 C504.2 C505.2 C506.2 C507.2 C508.2 C509.2 C510.2 C511.2 C512.2 C513.2 C514.2 C515.2 C516.2 D501.1(VDD) D502.1(VDD) D503.1(VDD) D504.1(VDD) D505.1(VDD) D506.1(VDD) D507.1(VDD) D508.1(VDD) D509.1(VDD) D510.1(VDD) D511.1(VDD) D512.1(VDD) D513.1(VDD) D514.1(VDD) D515.1(VDD) D516.1(VDD) Q501.3(D) U502.5(VCC)
VSYS: BZ501.1 D517.2(K) Q501.2(S) R502.2 R509.1
BLUE: R512.2 ; port SIG_B
BUZZ: R510.2 ; port BUZZ
ENC_A: CON502.3 U501.A(B) ; port ROT_A
ENC_B: CON502.1 U501.B ; port ROT_B
GREEN: R513.2 ; port SIG_G
P0.04: U502.2(A) ; port UG_IN
P0.05: R508.1 ; port SIG_R
ROT_SW_A1: CON501.1 U501.1 ; port ROT_SW_A1
ROT_SW_A2: CON501.2 U501.2 ; port ROT_SW_A2  [project net col7]
UG_OUT: D501.4(DIN) R507.1
NetBZ501_2: BZ501.2 D517.1(A) Q502.3(D) R509.2
NetD501_2: D501.2(DOUT) D502.4(DIN)
NetD502_2: D502.2(DOUT) D503.4(DIN)
NetD503_2: D503.2(DOUT) D504.4(DIN)
NetD504_2: D504.2(DOUT) D505.4(DIN)
NetD505_2: D505.2(DOUT) D506.4(DIN)
NetD506_2: D506.2(DOUT) D507.4(DIN)
NetD507_2: D507.2(DOUT) D508.4(DIN)
NetD508_2: D508.2(DOUT) D509.4(DIN)
NetD509_2: D509.2(DOUT) D510.4(DIN)
NetD510_2: D510.2(DOUT) D511.4(DIN)
NetD511_2: D511.2(DOUT) D512.4(DIN)
NetD512_2: D512.2(DOUT) D513.4(DIN)
NetD513_2: D513.2(DOUT) D514.4(DIN)
NetD514_2: D514.2(DOUT) D515.4(DIN)
NetD515_2: D515.2(DOUT) D516.4(DIN)
NetD518_1: D518.1(B_C) R512.1
NetD518_2: D518.2(G_C) R513.1
NetD518_3: D518.3(R_C) R508.2
NetQ501_1: Q501.1(G) Q503.3(D) R502.1
NetQ502_1: Q502.1(G) R510.1 R511.1
NetQ503_1: Q503.1(G) R501.2 R515.1
NetR501_1: R501.1 ; port POWER_PIN
NetR507_2: R507.2 U502.4(Y)

Not connected (* = marked no-connect by the designer): D516 2(DOUT); U501 M

### Notes on the sheet
- Also compatible with SK6812 MINI-HS
- Title
- Size:
- Date:
- A4
- Number:
- Time:
- Revision:
- Sheet
- of
- File:

### Library data of the parts
BZ501 = Speaker: Loudspeaker; MRF.Part: YS-SBZ1230; LCSC MFG: Fengming; LCSC Part #: C409829
C501-C516 = Cap: as C302 on sheet 3_cyber60-mxhs_mcu; Version: 0603 imperial; LCSC Part #: C14663
CON501 = Header 2: Header, 2-Pin
CON502 = Header 3: Header, 3-Pin
D501-D516 = WS2812B: MRF.Part: WS2812C-2020; LCSC MFG: Worldsemi; LCSC Part #: C965556
D517 = Diode: Default Diode; LCSC MFG: Changjiang Electronics Tech (CJ); Version: SOD-123; LCSC Part #: C8598; MRF.Part: B5819W
D518 = SONGXIN 6028RGB: MFGPN: SMD 3528/6028; MFG: SONGXIN 6028RGB
Q501 = PMOS-2: as Q401 on sheet 4_cyber60-mxhs_power; LCSC Part #: C10487
Q502 Q503 = MOSFET-N: as Q404 on sheet 4_cyber60-mxhs_power; LCSC Part #: C8545; MRF.Part: 2N7002
R501 R507 R508 R510 R512 R513 = Res1: as R405 on sheet 4_cyber60-mxhs_power; Version: 0603 imperial; LCSC Part #: C23138
R502 = Res1: as R409 on sheet 4_cyber60-mxhs_power; Version: 0603 imperial; LCSC Part #: C22976
R509 = Res1: Resistor; MRF.Part: 0603WAF6800T5E; LCSC MFG: Uniroyal Elec; Version: 0603 imperial; LCSC Part #: C23228
R511 R515 = Res1: as R404 on sheet 4_cyber60-mxhs_power; Version: 0603 imperial; LCSC Part #: C25803
U501 = EC-11
U502 = SN74LV1T125: SN74LV1T125 or SN74LV1T34. Connect OE to GND; MRF.Part: SN74LV1T125DBVR; LCSC MFG: Texas Instruments; LCSC Part #: C473338; Version: SOT-23
M1 M2 = Socket: LatestRevisionDate: 17-Jul-2002; LatestRevisionNote: Re-released for DXP Platform.; Publisher: Altium Limited

## Nets that join several sheets
GND: 3_cyber60-mxhs_mcu (17 pins), 4_cyber60-mxhs_power (17 pins), 5_cyber60-mxhs_periferals (42 pins)
VBUS: 3_cyber60-mxhs_mcu (C303.2 F301.1 U301.22), 4_cyber60-mxhs_power (5 pins)
VCC3V3: 3_cyber60-mxhs_mcu (5 pins), 4_cyber60-mxhs_power (C403.2 C404.2 U402.2), 5_cyber60-mxhs_periferals (D518.4)
VSYS: 4_cyber60-mxhs_power (C402.2 D402.2 Q401.2 U402.3), 5_cyber60-mxhs_periferals (5 pins)
BLUE: 3_cyber60-mxhs_mcu (U301.16), 5_cyber60-mxhs_periferals (R512.2)
BUZZ: 3_cyber60-mxhs_mcu (U301.18), 5_cyber60-mxhs_periferals (R510.2)
col1: 3_cyber60-mxhs_mcu (U301.4), 2_cyber60-mxhs_matrix (10 pins)
col2: 3_cyber60-mxhs_mcu (U301.5), 2_cyber60-mxhs_matrix (9 pins)
col3: 3_cyber60-mxhs_mcu (U301.19), 2_cyber60-mxhs_matrix (8 pins)
col4: 3_cyber60-mxhs_mcu (U301.35), 2_cyber60-mxhs_matrix (9 pins)
col5: 3_cyber60-mxhs_mcu (U301.36), 2_cyber60-mxhs_matrix (9 pins)
col6: 3_cyber60-mxhs_mcu (U301.34), 2_cyber60-mxhs_matrix (10 pins)
col7: 3_cyber60-mxhs_mcu (U301.30), 2_cyber60-mxhs_matrix (9 pins), 5_cyber60-mxhs_periferals (CON501.2 U501.2)
ENC_A: 3_cyber60-mxhs_mcu (U301.29), 5_cyber60-mxhs_periferals (CON502.3 U501.A)
ENC_B: 3_cyber60-mxhs_mcu (U301.28), 5_cyber60-mxhs_periferals (CON502.1 U501.B)
GREEN: 3_cyber60-mxhs_mcu (U301.15), 5_cyber60-mxhs_periferals (R513.2)
NetR501_1: 3_cyber60-mxhs_mcu (U301.11), 5_cyber60-mxhs_periferals (R501.1)
P0.02: 3_cyber60-mxhs_mcu (U301.7), 4_cyber60-mxhs_power (R405.1)
P0.03: 3_cyber60-mxhs_mcu (U301.6), 4_cyber60-mxhs_power (C405.2 R408.2 R409.1)
P0.04: 3_cyber60-mxhs_mcu (U301.12), 5_cyber60-mxhs_periferals (U502.2)
P0.05: 3_cyber60-mxhs_mcu (U301.13), 5_cyber60-mxhs_periferals (R508.1)
P0.12: 3_cyber60-mxhs_mcu (U301.17), 2_cyber60-mxhs_matrix (7 pins)
P0.19: 3_cyber60-mxhs_mcu (U301.20), 2_cyber60-mxhs_matrix (6 pins)
P0.22: 3_cyber60-mxhs_mcu (U301.26), 2_cyber60-mxhs_matrix (7 pins)
P0.28: 3_cyber60-mxhs_mcu (U301.8), 2_cyber60-mxhs_matrix (7 pins)
P1.00: 3_cyber60-mxhs_mcu (U301.27), 2_cyber60-mxhs_matrix (7 pins)
P1.04: 3_cyber60-mxhs_mcu (U301.33), 2_cyber60-mxhs_matrix (6 pins)
P1.10: 3_cyber60-mxhs_mcu (U301.3), 2_cyber60-mxhs_matrix (5 pins)
P1.11: 3_cyber60-mxhs_mcu (U301.2), 2_cyber60-mxhs_matrix (D258.2 D264.2 D266.2 D270.2)
ROT_SW_A1: 2_cyber60-mxhs_matrix (D270.1), 5_cyber60-mxhs_periferals (CON501.1 U501.1)
row2: 3_cyber60-mxhs_mcu (U301.9), 2_cyber60-mxhs_matrix (7 pins)
row3: 3_cyber60-mxhs_mcu (U301.10), 2_cyber60-mxhs_matrix (7 pins)

## Assembly variants
All: all parts fitted
Bakeneko: not fitted CON301 R301 R302
Tray: not fitted CON303